# EAGLE schematic data_proV1 (EAGLE 7.6.0)
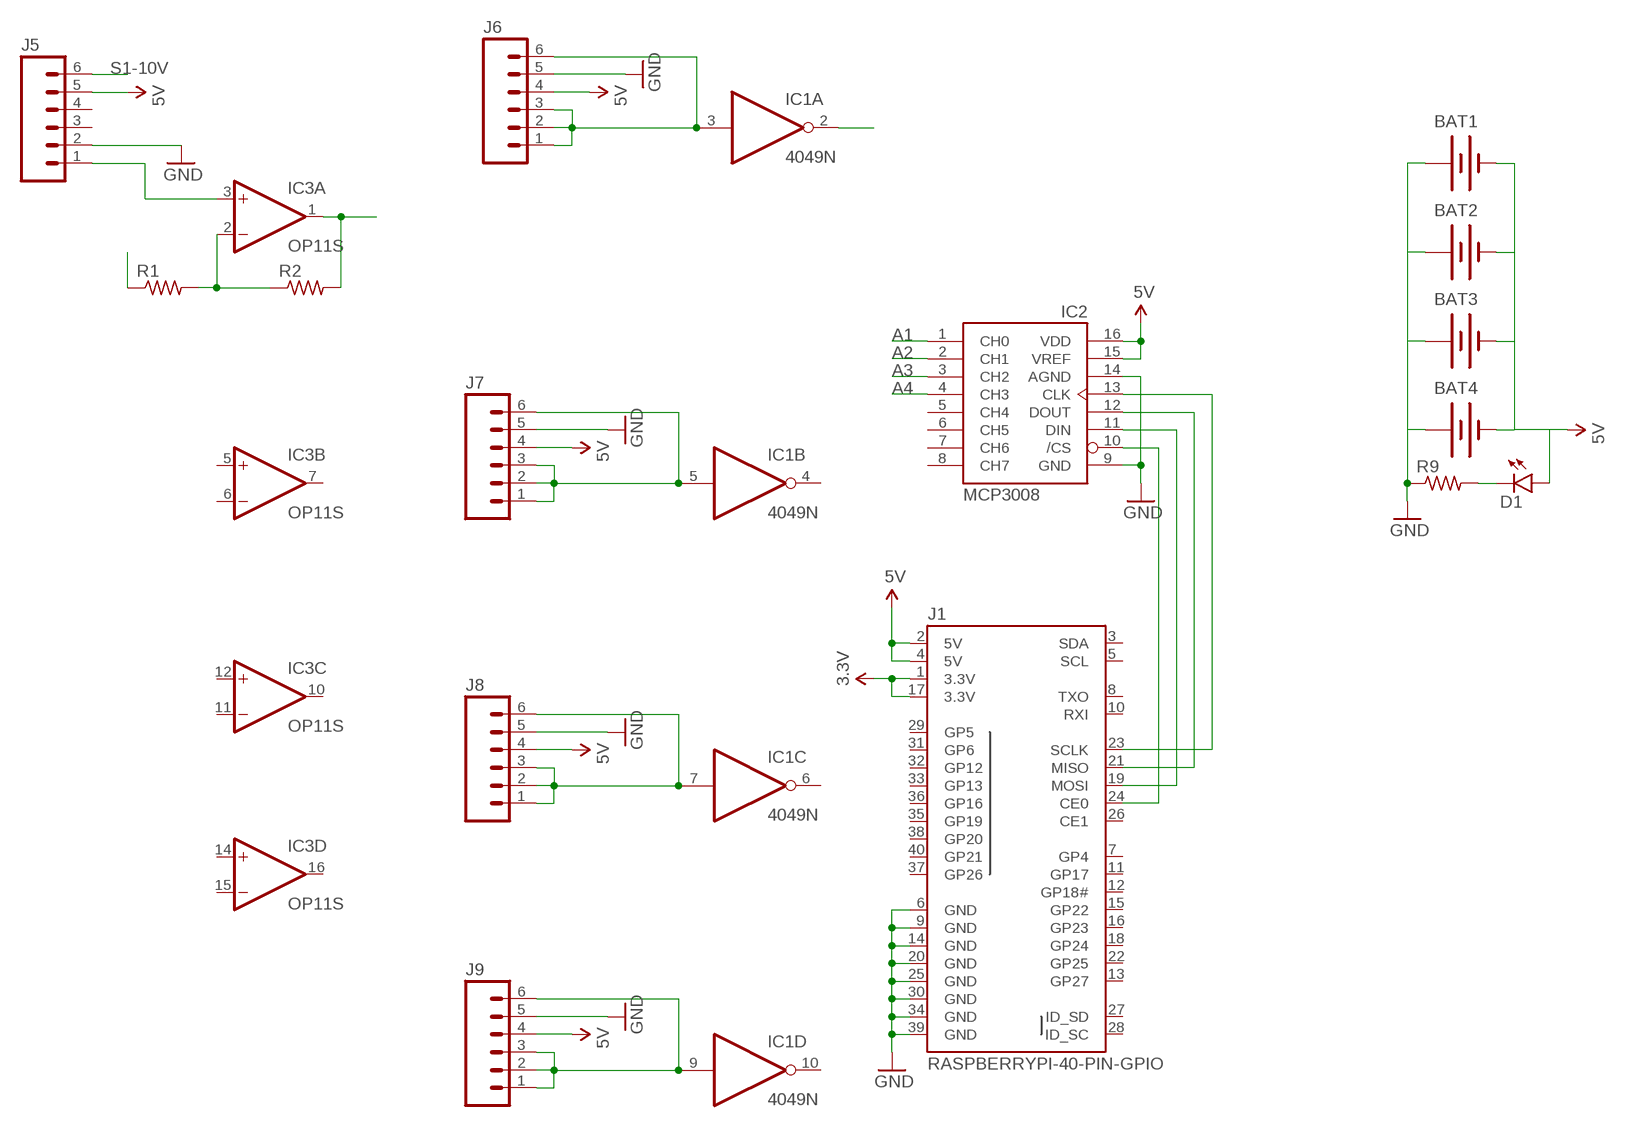
[diagram p0: schematic, sheet 1]

## Parts
BAT1  BATTERYAA  [BATTERY-AA]
BAT2  BATTERYAA  [BATTERY-AA]
BAT3  BATTERYAA  [BATTERY-AA]
BAT4  BATTERYAA  [BATTERY-AA]
D1  LED3MM  [LED3MM]
IC1  4049N  [DIL16]
IC2  MCP3008  [DIL16]
IC3  OP11S  [DIL16]
J1  RASPBERRYPI-40-PIN-GPIO  [2X20-SHROUDED]
J5  M06VERNIER-ANALOG  [BTA]
J6  M06VERNIER-DIGITAL  [BTD]
J7  M06VERNIER-DIGITAL  [BTD]
J8  M06VERNIER-DIGITAL  [BTD]
J9  M06VERNIER-DIGITAL  [BTD]
R1  R-US_R0805  [R0805]
R2  R-US_R0805  [R0805]
R9  R-US_R0805  [R0805]

## Nets
3.3V: J1.1(3.3V) J1.17(3.3V)
5V: D1.A IC2.15(VREF) IC2.16(VDD) J1.2(5V) J1.4(5V) J5.5 J6.4 J7.4 J8.4 J9.4
A1: IC2.1(CH0)
A2: IC2.2(CH1)
A3: IC2.3(CH2)
A4: IC2.4(CH3)
GND: BAT1.PWR@1(+) BAT2.PWR@1(+) BAT3.PWR@1(+) BAT4.PWR@1(+) IC2.9(GND) IC2.14(AGND) J1.6(GND) J1.9(GND) J1.14(GND) J1.20(GND) J1.25(GND) J1.30(GND) J1.34(GND) J1.39(GND) J5.2 J6.5 J7.5 J8.5 J9.5 R9.1
N$1: IC2.13(CLK) J1.23(SCLK)
N$2: IC2.12(DOUT) J1.21(MISO)
N$3: IC2.11(DIN) J1.19(MOSI)
N$4: IC2.10(/CS) J1.24(CE0)
N$5: IC3.2(A:-IN) R1.2 R2.1
N$6: IC3.1(A:OUT) R2.2
N$7: R1.1
N$9: BAT1.GND@1(-) BAT2.GND@1(-) BAT3.GND@1(-) BAT4.GND@1(-)
N$10: D1.K(C) R9.2
N$11: IC1.3(A:I) J6.1 J6.2 J6.3 J6.6
N$12: IC1.5(B:I) J7.1 J7.2 J7.3 J7.6
N$13: IC1.2(A:O)
N$14: IC1.7(C:I) J8.1 J8.2 J8.3 J8.6
N$15: IC1.9(D:I) J9.1 J9.2 J9.3 J9.6
S1-5V3: IC3.3(A:+IN) J5.1
S1-10V: J5.6
Unconnected: IC1.4(B:O) IC1.6(C:O) IC1.10(D:O) IC1.11(E:I) IC1.12(E:O) IC1.14(F:I) IC1.15(F:O) IC2.5(CH4) IC2.6(CH5) IC2.7(CH6) IC2.8(CH7) IC3.5(B:+IN) IC3.6(B:-IN) IC3.7(B:OUT) IC3.10(C:OUT) IC3.11(C:-IN) IC3.12(C:+IN) IC3.14(D:+IN) IC3.15(D:-IN) IC3.16(D:OUT) J1.3(SDA) J1.5(SCL) J1.7(GP4) J1.8(TXO) J1.10(RXI) J1.11(GP17) J1.12(GP18#) J1.13(GP27) J1.15(GP22) J1.16(GP23) J1.18(GP24) J1.22(GP25) J1.26(CE1) J1.27(ID_SD) J1.28(ID_SC) J1.29(GP5) J1.31(GP6) J1.32(GP12) J1.33(GP13) J1.35(GP19) J1.36(GP16) J1.37(GP26) J1.38(GP20) J1.40(GP21) J5.3 J5.4

## Power pins joined to a net without a drawn wire
V+: IC3.4(P:V+)
V-: IC3.13(P:V-)
VDD: IC1.1(P:VDD)
VSS: IC1.8(P:VSS)

## Library data of the parts
BAT1-BAT4 = SparkFun-Electromechanical:BATTERY: Battery Holders Various common sizes : AA, AAA, 18650 (PRT-12895), 20mm coin cell and 12mm coin cell. 20MM_4LEGS, BATT-10373
D1 = SparkFun-LED:LED: LEDs Standard schematic elements and footprints for 5mm, 3mm, 1206, and 0603 sized LEDs. 5mm - Spark Fun Electronics SKU : COM-00529 (and others); PROD_ID: DIO-08794
IC1 = 40xx:4049: Hex inverting BUFFER
IC2 = adafruit:MCP3008
IC3 = linear:OP11: Quad Low-Offset Low-Power OP AMP The OP-11 is pin compatible with the OP-400 , LM148, HA4741, RM4156, and LT1014 operational amplifiers source http://products.analog.com/products/info.asp?product=OP400
J1 = SparkFun-Boards:RASPBERRYPI-40-PIN-GPIO: Second Generation Raspberry Pi GPIO Header 2x20 pin connector, as found on B, B+, A+ models.
J5-J9 = SparkFun-Connectors:M06: Header 6 Standard 6-pin 0.1" header. Use with straight break away headers (SKU : PRT-00116), right angle break away headers (PRT-00553), swiss pins (PRT-00743), machine pins (PRT-00117), and female headers (PRT-00115). Molex polarized connector foot print use with SKU : PRT-08094 with associated crimp pins and housings. NOTES ON THE VARIANTS LOCK and LOCK_LONGPADS... This footprint was designed to help hold the alignment of a through-hole component (i.e. 6-pin header) while soldering it into place. You may notice that each hole has been shifted either up or down by 0.005 of an inch from it's more standard position (which is a perfectly straight line). This slight alteration caused the pins (the squares in the middle) to touch the edges of the holes. Because they are alternating, it causes a "brace" to hold the component in place. 0.005 has proven to be the perfect amount of "off-center" position when using our standard breakaway headers. Although looks a little odd when you look at the bare footprint, once you have a header in there, the alteration is very hard to notice. Also,if you push a header all the way into place, it is covered up entirely on the bottom side. This idea of altering the position of holes to aid alignment will be further integrated into the Sparkfun Library for other footprints. It can help hold any component with 3 or more connection pins.
R1 R2 R9 = resistor:R-US_: RESISTOR, American symbol